# EAGLE schematic flip (EAGLE 6.2), part 1 of 2
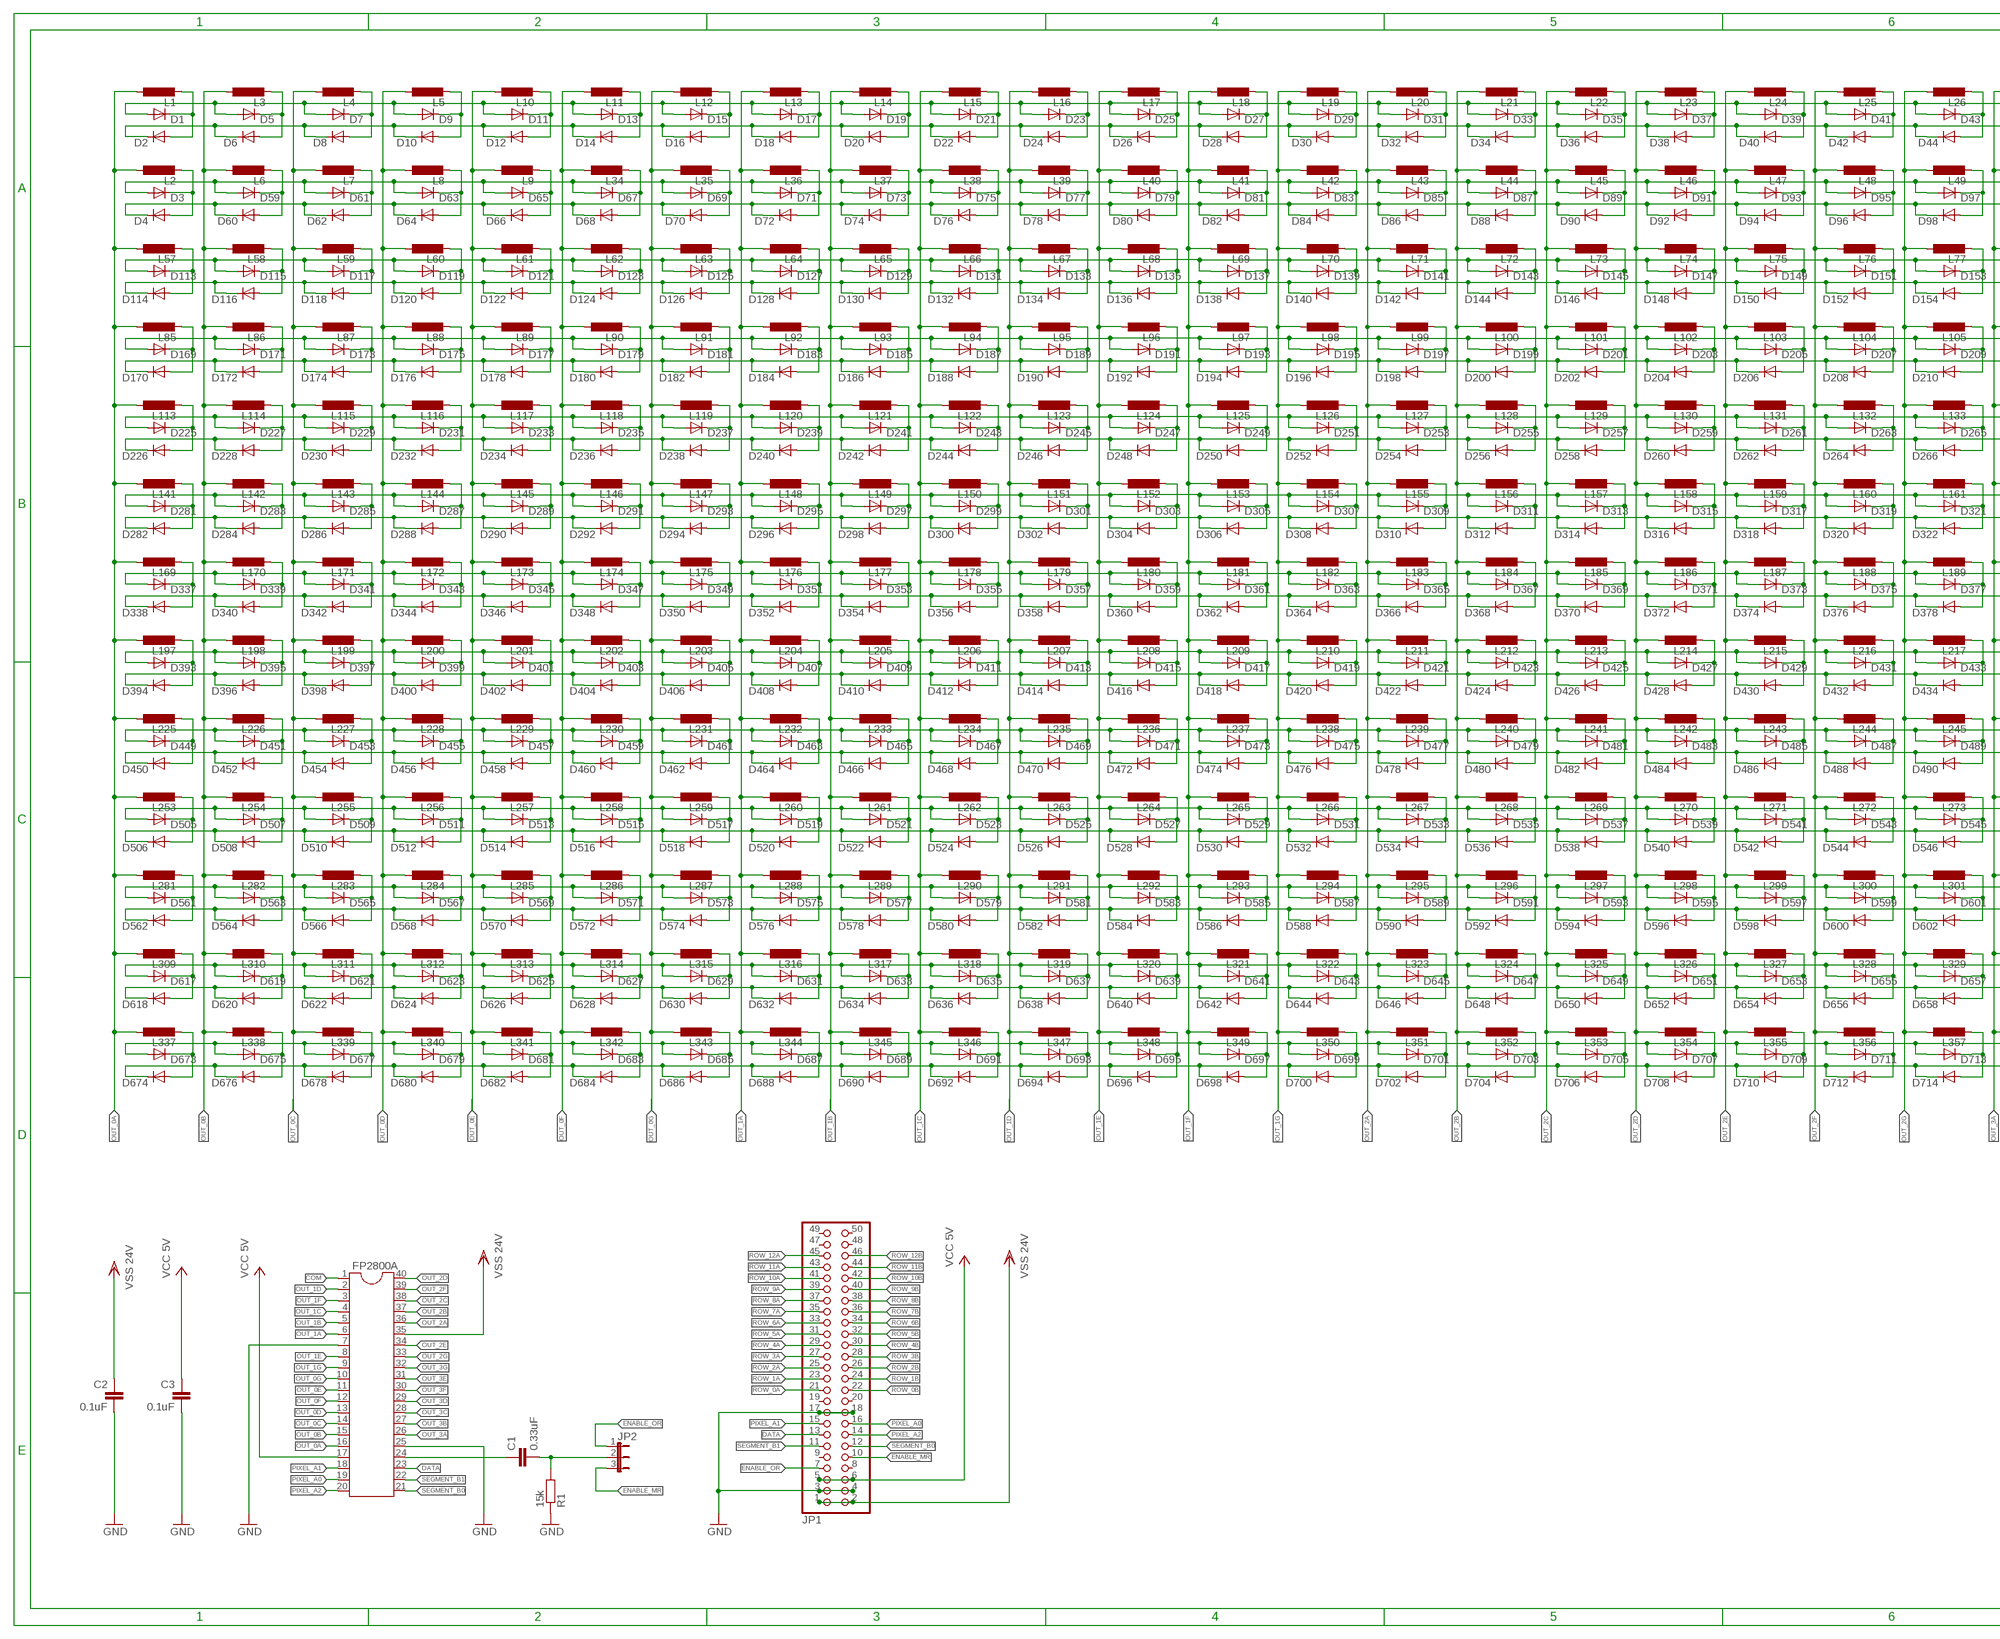
[diagram p0: schematic, sheet 1, part 1 of 2]
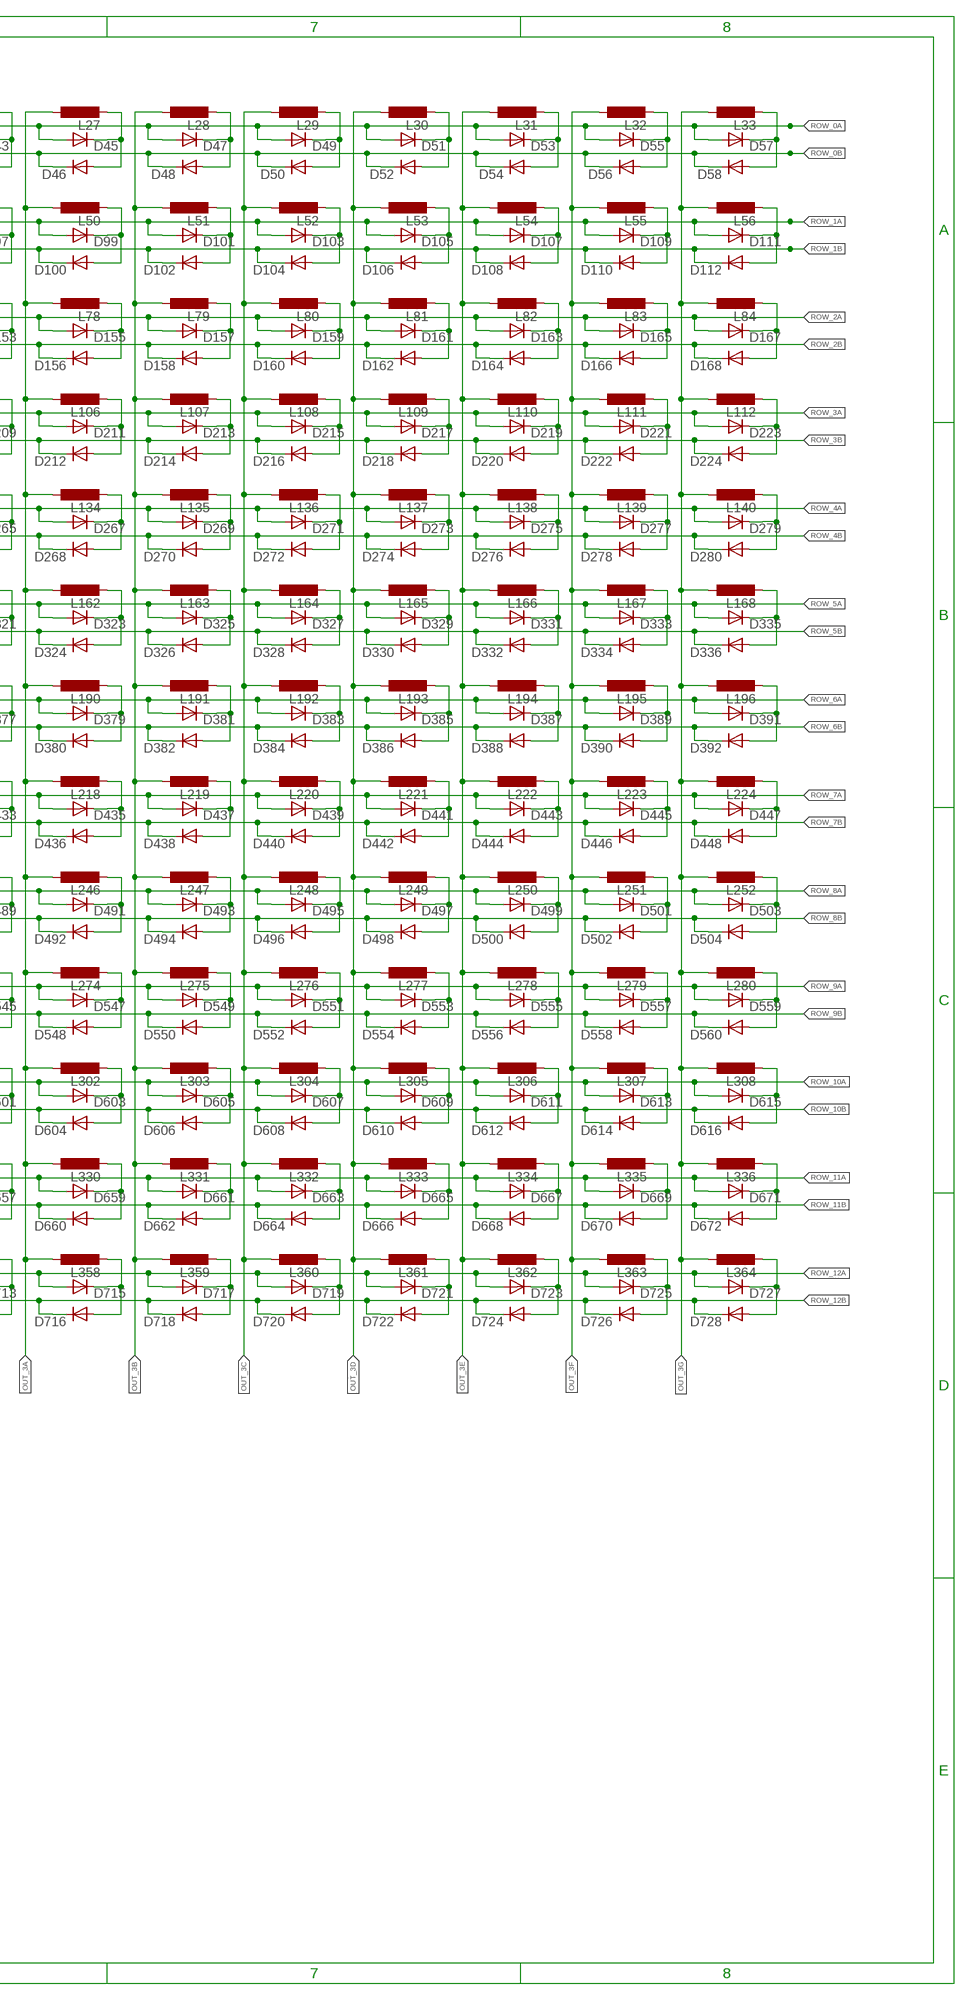
[diagram p1: schematic, sheet 1, part 2 of 2]

## Parts
C1  0.33uF  C-EU075-032X103  [C075-032X103]
C2  0.1uF  C-EU075-032X103  [C075-032X103]
C3  0.1uF  C-EU075-032X103  [C075-032X103]
D1  1N4446  [DO35-10]
D2  1N4446  [DO35-10]
D3  1N4446  [DO35-10]
D4  1N4446  [DO35-10]
D5  1N4446  [DO35-10]
D6  1N4446  [DO35-10]
D7  1N4446  [DO35-10]
D8  1N4446  [DO35-10]
D9  1N4446  [DO35-10]
D10  1N4446  [DO35-10]
D11  1N4446  [DO35-10]
D12  1N4446  [DO35-10]
D13  1N4446  [DO35-10]
D14  1N4446  [DO35-10]
D15  1N4446  [DO35-10]
D16  1N4446  [DO35-10]
D17  1N4446  [DO35-10]
D18  1N4446  [DO35-10]
D19  1N4446  [DO35-10]
D20  1N4446  [DO35-10]
D21  1N4446  [DO35-10]
D22  1N4446  [DO35-10]
D23  1N4446  [DO35-10]
D24  1N4446  [DO35-10]
D25  1N4446  [DO35-10]
D26  1N4446  [DO35-10]
D27  1N4446  [DO35-10]
D28  1N4446  [DO35-10]
D29  1N4446  [DO35-10]
D30  1N4446  [DO35-10]
D31  1N4446  [DO35-10]
D32  1N4446  [DO35-10]
D33  1N4446  [DO35-10]
D34  1N4446  [DO35-10]
D35  1N4446  [DO35-10]
D36  1N4446  [DO35-10]
D37  1N4446  [DO35-10]
D38  1N4446  [DO35-10]
D39  1N4446  [DO35-10]
D40  1N4446  [DO35-10]
D41  1N4446  [DO35-10]
D42  1N4446  [DO35-10]
D43  1N4446  [DO35-10]
D44  1N4446  [DO35-10]
D45  1N4446  [DO35-10]
D46  1N4446  [DO35-10]
D47  1N4446  [DO35-10]
D48  1N4446  [DO35-10]
D49  1N4446  [DO35-10]
D50  1N4446  [DO35-10]
D51  1N4446  [DO35-10]
D52  1N4446  [DO35-10]
D53  1N4446  [DO35-10]
D54  1N4446  [DO35-10]
D55  1N4446  [DO35-10]
D56  1N4446  [DO35-10]
D57  1N4446  [DO35-10]
D58  1N4446  [DO35-10]
D59  1N4446  [DO35-10]
D60  1N4446  [DO35-10]
D61  1N4446  [DO35-10]
D62  1N4446  [DO35-10]
D63  1N4446  [DO35-10]
D64  1N4446  [DO35-10]
D65  1N4446  [DO35-10]
D66  1N4446  [DO35-10]
D67  1N4446  [DO35-10]
D68  1N4446  [DO35-10]
D69  1N4446  [DO35-10]
D70  1N4446  [DO35-10]
D71  1N4446  [DO35-10]
D72  1N4446  [DO35-10]
D73  1N4446  [DO35-10]
D74  1N4446  [DO35-10]
D75  1N4446  [DO35-10]
D76  1N4446  [DO35-10]
D77  1N4446  [DO35-10]
D78  1N4446  [DO35-10]
D79  1N4446  [DO35-10]
D80  1N4446  [DO35-10]
D81  1N4446  [DO35-10]
D82  1N4446  [DO35-10]
D83  1N4446  [DO35-10]
D84  1N4446  [DO35-10]
D85  1N4446  [DO35-10]
D86  1N4446  [DO35-10]
D87  1N4446  [DO35-10]
D88  1N4446  [DO35-10]
D89  1N4446  [DO35-10]
D90  1N4446  [DO35-10]
D91  1N4446  [DO35-10]
D92  1N4446  [DO35-10]
D93  1N4446  [DO35-10]
D94  1N4446  [DO35-10]
D95  1N4446  [DO35-10]
D96  1N4446  [DO35-10]
D97  1N4446  [DO35-10]
D98  1N4446  [DO35-10]
D99  1N4446  [DO35-10]
D100  1N4446  [DO35-10]
D101  1N4446  [DO35-10]
D102  1N4446  [DO35-10]
D103  1N4446  [DO35-10]
D104  1N4446  [DO35-10]
D105  1N4446  [DO35-10]
D106  1N4446  [DO35-10]
D107  1N4446  [DO35-10]
D108  1N4446  [DO35-10]
D109  1N4446  [DO35-10]
D110  1N4446  [DO35-10]
D111  1N4446  [DO35-10]
D112  1N4446  [DO35-10]
D113  1N4446  [DO35-10]
D114  1N4446  [DO35-10]
D115  1N4446  [DO35-10]
D116  1N4446  [DO35-10]
D117  1N4446  [DO35-10]
D118  1N4446  [DO35-10]
D119  1N4446  [DO35-10]
D120  1N4446  [DO35-10]
D121  1N4446  [DO35-10]
D122  1N4446  [DO35-10]
D123  1N4446  [DO35-10]
D124  1N4446  [DO35-10]
D125  1N4446  [DO35-10]
D126  1N4446  [DO35-10]
D127  1N4446  [DO35-10]
D128  1N4446  [DO35-10]
D129  1N4446  [DO35-10]
D130  1N4446  [DO35-10]
D131  1N4446  [DO35-10]
D132  1N4446  [DO35-10]
D133  1N4446  [DO35-10]
D134  1N4446  [DO35-10]
D135  1N4446  [DO35-10]
D136  1N4446  [DO35-10]
D137  1N4446  [DO35-10]
D138  1N4446  [DO35-10]
D139  1N4446  [DO35-10]
D140  1N4446  [DO35-10]
D141  1N4446  [DO35-10]
D142  1N4446  [DO35-10]
D143  1N4446  [DO35-10]
D144  1N4446  [DO35-10]
D145  1N4446  [DO35-10]
D146  1N4446  [DO35-10]
D147  1N4446  [DO35-10]
D148  1N4446  [DO35-10]
D149  1N4446  [DO35-10]
D150  1N4446  [DO35-10]
D151  1N4446  [DO35-10]
D152  1N4446  [DO35-10]
D153  1N4446  [DO35-10]
D154  1N4446  [DO35-10]
D155  1N4446  [DO35-10]
D156  1N4446  [DO35-10]
D157  1N4446  [DO35-10]
D158  1N4446  [DO35-10]
D159  1N4446  [DO35-10]
D160  1N4446  [DO35-10]
D161  1N4446  [DO35-10]
D162  1N4446  [DO35-10]
D163  1N4446  [DO35-10]
D164  1N4446  [DO35-10]
D165  1N4446  [DO35-10]
D166  1N4446  [DO35-10]
D167  1N4446  [DO35-10]
D168  1N4446  [DO35-10]
D169  1N4446  [DO35-10]
D170  1N4446  [DO35-10]
D171  1N4446  [DO35-10]
D172  1N4446  [DO35-10]
D173  1N4446  [DO35-10]
D174  1N4446  [DO35-10]
D175  1N4446  [DO35-10]
D176  1N4446  [DO35-10]
D177  1N4446  [DO35-10]
D178  1N4446  [DO35-10]
D179  1N4446  [DO35-10]
D180  1N4446  [DO35-10]
D181  1N4446  [DO35-10]
D182  1N4446  [DO35-10]
D183  1N4446  [DO35-10]
D184  1N4446  [DO35-10]
D185  1N4446  [DO35-10]
D186  1N4446  [DO35-10]
D187  1N4446  [DO35-10]
D188  1N4446  [DO35-10]
D189  1N4446  [DO35-10]
D190  1N4446  [DO35-10]
D191  1N4446  [DO35-10]
D192  1N4446  [DO35-10]
D193  1N4446  [DO35-10]
D194  1N4446  [DO35-10]
D195  1N4446  [DO35-10]
D196  1N4446  [DO35-10]
D197  1N4446  [DO35-10]
D198  1N4446  [DO35-10]
D199  1N4446  [DO35-10]
D200  1N4446  [DO35-10]
D201  1N4446  [DO35-10]
D202  1N4446  [DO35-10]
D203  1N4446  [DO35-10]
D204  1N4446  [DO35-10]
D205  1N4446  [DO35-10]
D206  1N4446  [DO35-10]
D207  1N4446  [DO35-10]
D208  1N4446  [DO35-10]
D209  1N4446  [DO35-10]
D210  1N4446  [DO35-10]
D211  1N4446  [DO35-10]
D212  1N4446  [DO35-10]
D213  1N4446  [DO35-10]
D214  1N4446  [DO35-10]
D215  1N4446  [DO35-10]
D216  1N4446  [DO35-10]
D217  1N4446  [DO35-10]
D218  1N4446  [DO35-10]
D219  1N4446  [DO35-10]
D220  1N4446  [DO35-10]
D221  1N4446  [DO35-10]
D222  1N4446  [DO35-10]
D223  1N4446  [DO35-10]
D224  1N4446  [DO35-10]
D225  1N4446  [DO35-10]
D226  1N4446  [DO35-10]
D227  1N4446  [DO35-10]
D228  1N4446  [DO35-10]
D229  1N4446  [DO35-10]
D230  1N4446  [DO35-10]
D231  1N4446  [DO35-10]
D232  1N4446  [DO35-10]
D233  1N4446  [DO35-10]
D234  1N4446  [DO35-10]
D235  1N4446  [DO35-10]
D236  1N4446  [DO35-10]
D237  1N4446  [DO35-10]
D238  1N4446  [DO35-10]
D239  1N4446  [DO35-10]
D240  1N4446  [DO35-10]
D241  1N4446  [DO35-10]
D242  1N4446  [DO35-10]
D243  1N4446  [DO35-10]
D244  1N4446  [DO35-10]
D245  1N4446  [DO35-10]
D246  1N4446  [DO35-10]
D247  1N4446  [DO35-10]
D248  1N4446  [DO35-10]
D249  1N4446  [DO35-10]
D250  1N4446  [DO35-10]
D251  1N4446  [DO35-10]
D252  1N4446  [DO35-10]
D253  1N4446  [DO35-10]
D254  1N4446  [DO35-10]
D255  1N4446  [DO35-10]
D256  1N4446  [DO35-10]
D257  1N4446  [DO35-10]
D258  1N4446  [DO35-10]
D259  1N4446  [DO35-10]
D260  1N4446  [DO35-10]
D261  1N4446  [DO35-10]
D262  1N4446  [DO35-10]
D263  1N4446  [DO35-10]
D264  1N4446  [DO35-10]
D265  1N4446  [DO35-10]
D266  1N4446  [DO35-10]
D267  1N4446  [DO35-10]
D268  1N4446  [DO35-10]
D269  1N4446  [DO35-10]
D270  1N4446  [DO35-10]
D271  1N4446  [DO35-10]
D272  1N4446  [DO35-10]
D273  1N4446  [DO35-10]
D274  1N4446  [DO35-10]
D275  1N4446  [DO35-10]
D276  1N4446  [DO35-10]
D277  1N4446  [DO35-10]
D278  1N4446  [DO35-10]
D279  1N4446  [DO35-10]
D280  1N4446  [DO35-10]
D281  1N4446  [DO35-10]
D282  1N4446  [DO35-10]
D283  1N4446  [DO35-10]
D284  1N4446  [DO35-10]
D285  1N4446  [DO35-10]
D286  1N4446  [DO35-10]
D287  1N4446  [DO35-10]
D288  1N4446  [DO35-10]
D289  1N4446  [DO35-10]
D290  1N4446  [DO35-10]
D291  1N4446  [DO35-10]
D292  1N4446  [DO35-10]
D293  1N4446  [DO35-10]
D294  1N4446  [DO35-10]
D295  1N4446  [DO35-10]
D296  1N4446  [DO35-10]
D297  1N4446  [DO35-10]
D298  1N4446  [DO35-10]
D299  1N4446  [DO35-10]
D300  1N4446  [DO35-10]
D301  1N4446  [DO35-10]
D302  1N4446  [DO35-10]
D303  1N4446  [DO35-10]
D304  1N4446  [DO35-10]
D305  1N4446  [DO35-10]
D306  1N4446  [DO35-10]
D307  1N4446  [DO35-10]
D308  1N4446  [DO35-10]
D309  1N4446  [DO35-10]
D310  1N4446  [DO35-10]
D311  1N4446  [DO35-10]
D312  1N4446  [DO35-10]
D313  1N4446  [DO35-10]
D314  1N4446  [DO35-10]
D315  1N4446  [DO35-10]
D316  1N4446  [DO35-10]
D317  1N4446  [DO35-10]
D318  1N4446  [DO35-10]
D319  1N4446  [DO35-10]
D320  1N4446  [DO35-10]
D321  1N4446  [DO35-10]
D322  1N4446  [DO35-10]
D323  1N4446  [DO35-10]
D324  1N4446  [DO35-10]
D325  1N4446  [DO35-10]
D326  1N4446  [DO35-10]
D327  1N4446  [DO35-10]
D328  1N4446  [DO35-10]
D329  1N4446  [DO35-10]
D330  1N4446  [DO35-10]
D331  1N4446  [DO35-10]
D332  1N4446  [DO35-10]
D333  1N4446  [DO35-10]
D334  1N4446  [DO35-10]
D335  1N4446  [DO35-10]
D336  1N4446  [DO35-10]
D337  1N4446  [DO35-10]
D338  1N4446  [DO35-10]
D339  1N4446  [DO35-10]
D340  1N4446  [DO35-10]
D341  1N4446  [DO35-10]
D342  1N4446  [DO35-10]
D343  1N4446  [DO35-10]
D344  1N4446  [DO35-10]
D345  1N4446  [DO35-10]
D346  1N4446  [DO35-10]
D347  1N4446  [DO35-10]
D348  1N4446  [DO35-10]
D349  1N4446  [DO35-10]
D350  1N4446  [DO35-10]
D351  1N4446  [DO35-10]
D352  1N4446  [DO35-10]
D353  1N4446  [DO35-10]
D354  1N4446  [DO35-10]
D355  1N4446  [DO35-10]
D356  1N4446  [DO35-10]
D357  1N4446  [DO35-10]
D358  1N4446  [DO35-10]
D359  1N4446  [DO35-10]
D360  1N4446  [DO35-10]
D361  1N4446  [DO35-10]
D362  1N4446  [DO35-10]
D363  1N4446  [DO35-10]
D364  1N4446  [DO35-10]
D365  1N4446  [DO35-10]
D366  1N4446  [DO35-10]
D367  1N4446  [DO35-10]
D368  1N4446  [DO35-10]
D369  1N4446  [DO35-10]
D370  1N4446  [DO35-10]
D371  1N4446  [DO35-10]
D372  1N4446  [DO35-10]
D373  1N4446  [DO35-10]
D374  1N4446  [DO35-10]
D375  1N4446  [DO35-10]
D376  1N4446  [DO35-10]
D377  1N4446  [DO35-10]
D378  1N4446  [DO35-10]
D379  1N4446  [DO35-10]
D380  1N4446  [DO35-10]
D381  1N4446  [DO35-10]
D382  1N4446  [DO35-10]
D383  1N4446  [DO35-10]
D384  1N4446  [DO35-10]
D385  1N4446  [DO35-10]
D386  1N4446  [DO35-10]
D387  1N4446  [DO35-10]
D388  1N4446  [DO35-10]
D389  1N4446  [DO35-10]
D390  1N4446  [DO35-10]
D391  1N4446  [DO35-10]
D392  1N4446  [DO35-10]
D393  1N4446  [DO35-10]
D394  1N4446  [DO35-10]
D395  1N4446  [DO35-10]
D396  1N4446  [DO35-10]
D397  1N4446  [DO35-10]
D398  1N4446  [DO35-10]
D399  1N4446  [DO35-10]
D400  1N4446  [DO35-10]
D401  1N4446  [DO35-10]
D402  1N4446  [DO35-10]
D403  1N4446  [DO35-10]
D404  1N4446  [DO35-10]
D405  1N4446  [DO35-10]
D406  1N4446  [DO35-10]
D407  1N4446  [DO35-10]
D408  1N4446  [DO35-10]
D409  1N4446  [DO35-10]
D410  1N4446  [DO35-10]
D411  1N4446  [DO35-10]
D412  1N4446  [DO35-10]
D413  1N4446  [DO35-10]
D414  1N4446  [DO35-10]
D415  1N4446  [DO35-10]
D416  1N4446  [DO35-10]
D417  1N4446  [DO35-10]
D418  1N4446  [DO35-10]
D419  1N4446  [DO35-10]
D420  1N4446  [DO35-10]
D421  1N4446  [DO35-10]
D422  1N4446  [DO35-10]
D423  1N4446  [DO35-10]
D424  1N4446  [DO35-10]
D425  1N4446  [DO35-10]
D426  1N4446  [DO35-10]
D427  1N4446  [DO35-10]
D428  1N4446  [DO35-10]
D429  1N4446  [DO35-10]
D430  1N4446  [DO35-10]
D431  1N4446  [DO35-10]
D432  1N4446  [DO35-10]
D433  1N4446  [DO35-10]
D434  1N4446  [DO35-10]
D435  1N4446  [DO35-10]
D436  1N4446  [DO35-10]
D437  1N4446  [DO35-10]
D438  1N4446  [DO35-10]
D439  1N4446  [DO35-10]
D440  1N4446  [DO35-10]
D441  1N4446  [DO35-10]
D442  1N4446  [DO35-10]
D443  1N4446  [DO35-10]
D444  1N4446  [DO35-10]
D445  1N4446  [DO35-10]
D446  1N4446  [DO35-10]
D447  1N4446  [DO35-10]
D448  1N4446  [DO35-10]
D449  1N4446  [DO35-10]
D450  1N4446  [DO35-10]
D451  1N4446  [DO35-10]
D452  1N4446  [DO35-10]
D453  1N4446  [DO35-10]
D454  1N4446  [DO35-10]
D455  1N4446  [DO35-10]
D456  1N4446  [DO35-10]
D457  1N4446  [DO35-10]
D458  1N4446  [DO35-10]
D459  1N4446  [DO35-10]
D460  1N4446  [DO35-10]
D461  1N4446  [DO35-10]
D462  1N4446  [DO35-10]
D463  1N4446  [DO35-10]
D464  1N4446  [DO35-10]
D465  1N4446  [DO35-10]
D466  1N4446  [DO35-10]
D467  1N4446  [DO35-10]
D468  1N4446  [DO35-10]
D469  1N4446  [DO35-10]
D470  1N4446  [DO35-10]
D471  1N4446  [DO35-10]
D472  1N4446  [DO35-10]
D473  1N4446  [DO35-10]
D474  1N4446  [DO35-10]
D475  1N4446  [DO35-10]
D476  1N4446  [DO35-10]
D477  1N4446  [DO35-10]
D478  1N4446  [DO35-10]
D479  1N4446  [DO35-10]
D480  1N4446  [DO35-10]
D481  1N4446  [DO35-10]
D482  1N4446  [DO35-10]
D483  1N4446  [DO35-10]
D484  1N4446  [DO35-10]
D485  1N4446  [DO35-10]
D486  1N4446  [DO35-10]
D487  1N4446  [DO35-10]
D488  1N4446  [DO35-10]
D489  1N4446  [DO35-10]
D490  1N4446  [DO35-10]
D491  1N4446  [DO35-10]
D492  1N4446  [DO35-10]
D493  1N4446  [DO35-10]
D494  1N4446  [DO35-10]
D495  1N4446  [DO35-10]
D496  1N4446  [DO35-10]
D497  1N4446  [DO35-10]
D498  1N4446  [DO35-10]
D499  1N4446  [DO35-10]
D500  1N4446  [DO35-10]
D501  1N4446  [DO35-10]
D502  1N4446  [DO35-10]
D503  1N4446  [DO35-10]
D504  1N4446  [DO35-10]
D505  1N4446  [DO35-10]
D506  1N4446  [DO35-10]
D507  1N4446  [DO35-10]
D508  1N4446  [DO35-10]
D509  1N4446  [DO35-10]
D510  1N4446  [DO35-10]
D511  1N4446  [DO35-10]
D512  1N4446  [DO35-10]
D513  1N4446  [DO35-10]
D514  1N4446  [DO35-10]
D515  1N4446  [DO35-10]
D516  1N4446  [DO35-10]
D517  1N4446  [DO35-10]
D518  1N4446  [DO35-10]
D519  1N4446  [DO35-10]
D520  1N4446  [DO35-10]
D521  1N4446  [DO35-10]
D522  1N4446  [DO35-10]
D523  1N4446  [DO35-10]
D524  1N4446  [DO35-10]
D525  1N4446  [DO35-10]
D526  1N4446  [DO35-10]
D527  1N4446  [DO35-10]
D528  1N4446  [DO35-10]
D529  1N4446  [DO35-10]
D530  1N4446  [DO35-10]
D531  1N4446  [DO35-10]
D532  1N4446  [DO35-10]
D533  1N4446  [DO35-10]
D534  1N4446  [DO35-10]
D535  1N4446  [DO35-10]
D536  1N4446  [DO35-10]
D537  1N4446  [DO35-10]
D538  1N4446  [DO35-10]
D539  1N4446  [DO35-10]
D540  1N4446  [DO35-10]
D541  1N4446  [DO35-10]
D542  1N4446  [DO35-10]
D543  1N4446  [DO35-10]
D544  1N4446  [DO35-10]
D545  1N4446  [DO35-10]
D546  1N4446  [DO35-10]
D547  1N4446  [DO35-10]
D548  1N4446  [DO35-10]
D549  1N4446  [DO35-10]
D550  1N4446  [DO35-10]
D551  1N4446  [DO35-10]
D552  1N4446  [DO35-10]
D553  1N4446  [DO35-10]
D554  1N4446  [DO35-10]
D555  1N4446  [DO35-10]
D556  1N4446  [DO35-10]
D557  1N4446  [DO35-10]
D558  1N4446  [DO35-10]
D559  1N4446  [DO35-10]
D560  1N4446  [DO35-10]
D561  1N4446  [DO35-10]
D562  1N4446  [DO35-10]
D563  1N4446  [DO35-10]
D564  1N4446  [DO35-10]
D565  1N4446  [DO35-10]
D566  1N4446  [DO35-10]
D567  1N4446  [DO35-10]
D568  1N4446  [DO35-10]
D569  1N4446  [DO35-10]
D570  1N4446  [DO35-10]
D571  1N4446  [DO35-10]
D572  1N4446  [DO35-10]
D573  1N4446  [DO35-10]
D574  1N4446  [DO35-10]
D575  1N4446  [DO35-10]
D576  1N4446  [DO35-10]
D577  1N4446  [DO35-10]
D578  1N4446  [DO35-10]
D579  1N4446  [DO35-10]
D580  1N4446  [DO35-10]
D581  1N4446  [DO35-10]
D582  1N4446  [DO35-10]
D583  1N4446  [DO35-10]
D584  1N4446  [DO35-10]
D585  1N4446  [DO35-10]
D586  1N4446  [DO35-10]
D587  1N4446  [DO35-10]
D588  1N4446  [DO35-10]
D589  1N4446  [DO35-10]
D590  1N4446  [DO35-10]
D591  1N4446  [DO35-10]
D592  1N4446  [DO35-10]
D593  1N4446  [DO35-10]
D594  1N4446  [DO35-10]
D595  1N4446  [DO35-10]
D596  1N4446  [DO35-10]
D597  1N4446  [DO35-10]
D598  1N4446  [DO35-10]
D599  1N4446  [DO35-10]
D600  1N4446  [DO35-10]
D601  1N4446  [DO35-10]
D602  1N4446  [DO35-10]
D603  1N4446  [DO35-10]
D604  1N4446  [DO35-10]
D605  1N4446  [DO35-10]
D606  1N4446  [DO35-10]
D607  1N4446  [DO35-10]
D608  1N4446  [DO35-10]
D609  1N4446  [DO35-10]
D610  1N4446  [DO35-10]
D611  1N4446  [DO35-10]
D612  1N4446  [DO35-10]
D613  1N4446  [DO35-10]
D614  1N4446  [DO35-10]
D615  1N4446  [DO35-10]
D616  1N4446  [DO35-10]
D617  1N4446  [DO35-10]
D618  1N4446  [DO35-10]
D619  1N4446  [DO35-10]
D620  1N4446  [DO35-10]
D621  1N4446  [DO35-10]
D622  1N4446  [DO35-10]
D623  1N4446  [DO35-10]
D624  1N4446  [DO35-10]
D625  1N4446  [DO35-10]
D626  1N4446  [DO35-10]
D627  1N4446  [DO35-10]
D628  1N4446  [DO35-10]
D629  1N4446  [DO35-10]
D630  1N4446  [DO35-10]
D631  1N4446  [DO35-10]
D632  1N4446  [DO35-10]
D633  1N4446  [DO35-10]
D634  1N4446  [DO35-10]
D635  1N4446  [DO35-10]
D636  1N4446  [DO35-10]
D637  1N4446  [DO35-10]
D638  1N4446  [DO35-10]
D639  1N4446  [DO35-10]
D640  1N4446  [DO35-10]
D641  1N4446  [DO35-10]
D642  1N4446  [DO35-10]
D643  1N4446  [DO35-10]
D644  1N4446  [DO35-10]
D645  1N4446  [DO35-10]
D646  1N4446  [DO35-10]
D647  1N4446  [DO35-10]
D648  1N4446  [DO35-10]
D649  1N4446  [DO35-10]
D650  1N4446  [DO35-10]
D651  1N4446  [DO35-10]
D652  1N4446  [DO35-10]
D653  1N4446  [DO35-10]
D654  1N4446  [DO35-10]
D655  1N4446  [DO35-10]
D656  1N4446  [DO35-10]
D657  1N4446  [DO35-10]
D658  1N4446  [DO35-10]
D659  1N4446  [DO35-10]
D660  1N4446  [DO35-10]
D661  1N4446  [DO35-10]
D662  1N4446  [DO35-10]
D663  1N4446  [DO35-10]
D664  1N4446  [DO35-10]
D665  1N4446  [DO35-10]
D666  1N4446  [DO35-10]
D667  1N4446  [DO35-10]
D668  1N4446  [DO35-10]
D669  1N4446  [DO35-10]
D670  1N4446  [DO35-10]
D671  1N4446  [DO35-10]
D672  1N4446  [DO35-10]
D673  1N4446  [DO35-10]
D674  1N4446  [DO35-10]
D675  1N4446  [DO35-10]
D676  1N4446  [DO35-10]
D677  1N4446  [DO35-10]
D678  1N4446  [DO35-10]
D679  1N4446  [DO35-10]
D680  1N4446  [DO35-10]
D681  1N4446  [DO35-10]
D682  1N4446  [DO35-10]
D683  1N4446  [DO35-10]
D684  1N4446  [DO35-10]
D685  1N4446  [DO35-10]
D686  1N4446  [DO35-10]
D687  1N4446  [DO35-10]
D688  1N4446  [DO35-10]
D689  1N4446  [DO35-10]
D690  1N4446  [DO35-10]
D691  1N4446  [DO35-10]
D692  1N4446  [DO35-10]
D693  1N4446  [DO35-10]
D694  1N4446  [DO35-10]
D695  1N4446  [DO35-10]
D696  1N4446  [DO35-10]
D697  1N4446  [DO35-10]
D698  1N4446  [DO35-10]
D699  1N4446  [DO35-10]
D700  1N4446  [DO35-10]
D701  1N4446  [DO35-10]
D702  1N4446  [DO35-10]
D703  1N4446  [DO35-10]
D704  1N4446  [DO35-10]
D705  1N4446  [DO35-10]
D706  1N4446  [DO35-10]
D707  1N4446  [DO35-10]
D708  1N4446  [DO35-10]
D709  1N4446  [DO35-10]
D710  1N4446  [DO35-10]
D711  1N4446  [DO35-10]
D712  1N4446  [DO35-10]
D713  1N4446  [DO35-10]
D714  1N4446  [DO35-10]
D715  1N4446  [DO35-10]
D716  1N4446  [DO35-10]
D717  1N4446  [DO35-10]
D718  1N4446  [DO35-10]
D719  1N4446  [DO35-10]
D720  1N4446  [DO35-10]
D721  1N4446  [DO35-10]
D722  1N4446  [DO35-10]
D723  1N4446  [DO35-10]
D724  1N4446  [DO35-10]
D725  1N4446  [DO35-10]
D726  1N4446  [DO35-10]
D727  1N4446  [DO35-10]
D728  1N4446  [DO35-10]
FP2800A  DIL40  [DIL40]
JP1  PINHD-2X25  [2X25]
JP2  JP2E  [JP2]
L1  L-EU0204/7  [0204/7]
L2  L-EU0204/7  [0204/7]
L3  L-EU0204/7  [0204/7]
L4  L-EU0204/7  [0204/7]
L5  L-EU0204/7  [0204/7]
L6  L-EU0204/7  [0204/7]
L7  L-EU0204/7  [0204/7]
L8  L-EU0204/7  [0204/7]
L9  L-EU0204/7  [0204/7]
L10  L-EU0204/7  [0204/7]
L11  L-EU0204/7  [0204/7]
L12  L-EU0204/7  [0204/7]
L13  L-EU0204/7  [0204/7]
L14  L-EU0204/7  [0204/7]
L15  L-EU0204/7  [0204/7]
L16  L-EU0204/7  [0204/7]
L17  L-EU0204/7  [0204/7]
L18  L-EU0204/7  [0204/7]
L19  L-EU0204/7  [0204/7]
L20  L-EU0204/7  [0204/7]
L21  L-EU0204/7  [0204/7]
L22  L-EU0204/7  [0204/7]
L23  L-EU0204/7  [0204/7]
L24  L-EU0204/7  [0204/7]
L25  L-EU0204/7  [0204/7]
L26  L-EU0204/7  [0204/7]
L27  L-EU0204/7  [0204/7]
L28  L-EU0204/7  [0204/7]
L29  L-EU0204/7  [0204/7]
L30  L-EU0204/7  [0204/7]
L31  L-EU0204/7  [0204/7]
L32  L-EU0204/7  [0204/7]
L33  L-EU0204/7  [0204/7]
L34  L-EU0204/7  [0204/7]
L35  L-EU0204/7  [0204/7]
L36  L-EU0204/7  [0204/7]
L37  L-EU0204/7  [0204/7]
L38  L-EU0204/7  [0204/7]
L39  L-EU0204/7  [0204/7]
L40  L-EU0204/7  [0204/7]
L41  L-EU0204/7  [0204/7]
L42  L-EU0204/7  [0204/7]
L43  L-EU0204/7  [0204/7]
L44  L-EU0204/7  [0204/7]
L45  L-EU0204/7  [0204/7]
L46  L-EU0204/7  [0204/7]
L47  L-EU0204/7  [0204/7]
L48  L-EU0204/7  [0204/7]
L49  L-EU0204/7  [0204/7]
L50  L-EU0204/7  [0204/7]
L51  L-EU0204/7  [0204/7]
L52  L-EU0204/7  [0204/7]
L53  L-EU0204/7  [0204/7]
L54  L-EU0204/7  [0204/7]
L55  L-EU0204/7  [0204/7]
L56  L-EU0204/7  [0204/7]
L57  L-EU0204/7  [0204/7]
L58  L-EU0204/7  [0204/7]
L59  L-EU0204/7  [0204/7]
L60  L-EU0204/7  [0204/7]
L61  L-EU0204/7  [0204/7]
L62  L-EU0204/7  [0204/7]
L63  L-EU0204/7  [0204/7]
L64  L-EU0204/7  [0204/7]
L65  L-EU0204/7  [0204/7]
L66  L-EU0204/7  [0204/7]
L67  L-EU0204/7  [0204/7]
L68  L-EU0204/7  [0204/7]
L69  L-EU0204/7  [0204/7]
L70  L-EU0204/7  [0204/7]
L71  L-EU0204/7  [0204/7]
L72  L-EU0204/7  [0204/7]
L73  L-EU0204/7  [0204/7]
L74  L-EU0204/7  [0204/7]
L75  L-EU0204/7  [0204/7]
L76  L-EU0204/7  [0204/7]
L77  L-EU0204/7  [0204/7]
L78  L-EU0204/7  [0204/7]
L79  L-EU0204/7  [0204/7]
L80  L-EU0204/7  [0204/7]
L81  L-EU0204/7  [0204/7]
L82  L-EU0204/7  [0204/7]
L83  L-EU0204/7  [0204/7]
L84  L-EU0204/7  [0204/7]
L85  L-EU0204/7  [0204/7]
L86  L-EU0204/7  [0204/7]
L87  L-EU0204/7  [0204/7]
L88  L-EU0204/7  [0204/7]
L89  L-EU0204/7  [0204/7]
L90  L-EU0204/7  [0204/7]
L91  L-EU0204/7  [0204/7]
L92  L-EU0204/7  [0204/7]
L93  L-EU0204/7  [0204/7]
L94  L-EU0204/7  [0204/7]
L95  L-EU0204/7  [0204/7]
L96  L-EU0204/7  [0204/7]
L97  L-EU0204/7  [0204/7]
L98  L-EU0204/7  [0204/7]
L99  L-EU0204/7  [0204/7]
L100  L-EU0204/7  [0204/7]
L101  L-EU0204/7  [0204/7]
L102  L-EU0204/7  [0204/7]
L103  L-EU0204/7  [0204/7]
L104  L-EU0204/7  [0204/7]
L105  L-EU0204/7  [0204/7]
L106  L-EU0204/7  [0204/7]
L107  L-EU0204/7  [0204/7]
L108  L-EU0204/7  [0204/7]
L109  L-EU0204/7  [0204/7]
L110  L-EU0204/7  [0204/7]
L111  L-EU0204/7  [0204/7]
L112  L-EU0204/7  [0204/7]
L113  L-EU0204/7  [0204/7]
L114  L-EU0204/7  [0204/7]
L115  L-EU0204/7  [0204/7]
L116  L-EU0204/7  [0204/7]
L117  L-EU0204/7  [0204/7]
L118  L-EU0204/7  [0204/7]
L119  L-EU0204/7  [0204/7]
L120  L-EU0204/7  [0204/7]
L121  L-EU0204/7  [0204/7]
L122  L-EU0204/7  [0204/7]
L123  L-EU0204/7  [0204/7]
L124  L-EU0204/7  [0204/7]
L125  L-EU0204/7  [0204/7]
L126  L-EU0204/7  [0204/7]
L127  L-EU0204/7  [0204/7]
L128  L-EU0204/7  [0204/7]
L129  L-EU0204/7  [0204/7]
L130  L-EU0204/7  [0204/7]
L131  L-EU0204/7  [0204/7]
L132  L-EU0204/7  [0204/7]
L133  L-EU0204/7  [0204/7]
L134  L-EU0204/7  [0204/7]
L135  L-EU0204/7  [0204/7]
L136  L-EU0204/7  [0204/7]
L137  L-EU0204/7  [0204/7]
L138  L-EU0204/7  [0204/7]
L139  L-EU0204/7  [0204/7]
L140  L-EU0204/7  [0204/7]
L141  L-EU0204/7  [0204/7]
L142  L-EU0204/7  [0204/7]
L143  L-EU0204/7  [0204/7]
L144  L-EU0204/7  [0204/7]
L145  L-EU0204/7  [0204/7]
L146  L-EU0204/7  [0204/7]
L147  L-EU0204/7  [0204/7]
L148  L-EU0204/7  [0204/7]
L149  L-EU0204/7  [0204/7]
L150  L-EU0204/7  [0204/7]
L151  L-EU0204/7  [0204/7]
L152  L-EU0204/7  [0204/7]
L153  L-EU0204/7  [0204/7]
L154  L-EU0204/7  [0204/7]
L155  L-EU0204/7  [0204/7]
L156  L-EU0204/7  [0204/7]
L157  L-EU0204/7  [0204/7]
L158  L-EU0204/7  [0204/7]
L159  L-EU0204/7  [0204/7]
L160  L-EU0204/7  [0204/7]
L161  L-EU0204/7  [0204/7]
L162  L-EU0204/7  [0204/7]
L163  L-EU0204/7  [0204/7]
L164  L-EU0204/7  [0204/7]
L165  L-EU0204/7  [0204/7]
L166  L-EU0204/7  [0204/7]
L167  L-EU0204/7  [0204/7]
L168  L-EU0204/7  [0204/7]
L169  L-EU0204/7  [0204/7]
L170  L-EU0204/7  [0204/7]
L171  L-EU0204/7  [0204/7]
L172  L-EU0204/7  [0204/7]
L173  L-EU0204/7  [0204/7]
L174  L-EU0204/7  [0204/7]
L175  L-EU0204/7  [0204/7]
L176  L-EU0204/7  [0204/7]
L177  L-EU0204/7  [0204/7]
L178  L-EU0204/7  [0204/7]
L179  L-EU0204/7  [0204/7]
L180  L-EU0204/7  [0204/7]
L181  L-EU0204/7  [0204/7]
L182  L-EU0204/7  [0204/7]
L183  L-EU0204/7  [0204/7]
L184  L-EU0204/7  [0204/7]
L185  L-EU0204/7  [0204/7]
L186  L-EU0204/7  [0204/7]
L187  L-EU0204/7  [0204/7]
L188  L-EU0204/7  [0204/7]
L189  L-EU0204/7  [0204/7]
L190  L-EU0204/7  [0204/7]
L191  L-EU0204/7  [0204/7]
L192  L-EU0204/7  [0204/7]
L193  L-EU0204/7  [0204/7]
L194  L-EU0204/7  [0204/7]
L195  L-EU0204/7  [0204/7]
L196  L-EU0204/7  [0204/7]
L197  L-EU0204/7  [0204/7]
L198  L-EU0204/7  [0204/7]
L199  L-EU0204/7  [0204/7]
L200  L-EU0204/7  [0204/7]
L201  L-EU0204/7  [0204/7]
L202  L-EU0204/7  [0204/7]
L203  L-EU0204/7  [0204/7]
L204  L-EU0204/7  [0204/7]
L205  L-EU0204/7  [0204/7]
L206  L-EU0204/7  [0204/7]
L207  L-EU0204/7  [0204/7]
L208  L-EU0204/7  [0204/7]
L209  L-EU0204/7  [0204/7]
L210  L-EU0204/7  [0204/7]
L211  L-EU0204/7  [0204/7]
L212  L-EU0204/7  [0204/7]
L213  L-EU0204/7  [0204/7]
L214  L-EU0204/7  [0204/7]
L215  L-EU0204/7  [0204/7]
L216  L-EU0204/7  [0204/7]
L217  L-EU0204/7  [0204/7]
L218  L-EU0204/7  [0204/7]
L219  L-EU0204/7  [0204/7]
L220  L-EU0204/7  [0204/7]
L221  L-EU0204/7  [0204/7]
L222  L-EU0204/7  [0204/7]
L223  L-EU0204/7  [0204/7]
L224  L-EU0204/7  [0204/7]
L225  L-EU0204/7  [0204/7]
L226  L-EU0204/7  [0204/7]
L227  L-EU0204/7  [0204/7]
L228  L-EU0204/7  [0204/7]
L229  L-EU0204/7  [0204/7]
L230  L-EU0204/7  [0204/7]
L231  L-EU0204/7  [0204/7]
L232  L-EU0204/7  [0204/7]
L233  L-EU0204/7  [0204/7]
L234  L-EU0204/7  [0204/7]
L235  L-EU0204/7  [0204/7]
L236  L-EU0204/7  [0204/7]
L237  L-EU0204/7  [0204/7]
L238  L-EU0204/7  [0204/7]
L239  L-EU0204/7  [0204/7]
L240  L-EU0204/7  [0204/7]
L241  L-EU0204/7  [0204/7]
L242  L-EU0204/7  [0204/7]
L243  L-EU0204/7  [0204/7]
L244  L-EU0204/7  [0204/7]
L245  L-EU0204/7  [0204/7]
L246  L-EU0204/7  [0204/7]
L247  L-EU0204/7  [0204/7]
L248  L-EU0204/7  [0204/7]
L249  L-EU0204/7  [0204/7]
L250  L-EU0204/7  [0204/7]
L251  L-EU0204/7  [0204/7]
L252  L-EU0204/7  [0204/7]
L253  L-EU0204/7  [0204/7]
L254  L-EU0204/7  [0204/7]
L255  L-EU0204/7  [0204/7]
L256  L-EU0204/7  [0204/7]
L257  L-EU0204/7  [0204/7]
L258  L-EU0204/7  [0204/7]
L259  L-EU0204/7  [0204/7]
L260  L-EU0204/7  [0204/7]
L261  L-EU0204/7  [0204/7]
L262  L-EU0204/7  [0204/7]
L263  L-EU0204/7  [0204/7]
L264  L-EU0204/7  [0204/7]
L265  L-EU0204/7  [0204/7]
L266  L-EU0204/7  [0204/7]
L267  L-EU0204/7  [0204/7]
L268  L-EU0204/7  [0204/7]
L269  L-EU0204/7  [0204/7]
L270  L-EU0204/7  [0204/7]
L271  L-EU0204/7  [0204/7]
L272  L-EU0204/7  [0204/7]
L273  L-EU0204/7  [0204/7]
L274  L-EU0204/7  [0204/7]
L275  L-EU0204/7  [0204/7]
L276  L-EU0204/7  [0204/7]
L277  L-EU0204/7  [0204/7]
L278  L-EU0204/7  [0204/7]
L279  L-EU0204/7  [0204/7]
L280  L-EU0204/7  [0204/7]
L281  L-EU0204/7  [0204/7]
L282  L-EU0204/7  [0204/7]
L283  L-EU0204/7  [0204/7]
L284  L-EU0204/7  [0204/7]
L285  L-EU0204/7  [0204/7]
L286  L-EU0204/7  [0204/7]
L287  L-EU0204/7  [0204/7]
L288  L-EU0204/7  [0204/7]
L289  L-EU0204/7  [0204/7]
L290  L-EU0204/7  [0204/7]
L291  L-EU0204/7  [0204/7]
L292  L-EU0204/7  [0204/7]
L293  L-EU0204/7  [0204/7]
L294  L-EU0204/7  [0204/7]
L295  L-EU0204/7  [0204/7]
L296  L-EU0204/7  [0204/7]
L297  L-EU0204/7  [0204/7]
L298  L-EU0204/7  [0204/7]
L299  L-EU0204/7  [0204/7]
L300  L-EU0204/7  [0204/7]
L301  L-EU0204/7  [0204/7]
L302  L-EU0204/7  [0204/7]
L303  L-EU0204/7  [0204/7]
L304  L-EU0204/7  [0204/7]
L305  L-EU0204/7  [0204/7]
L306  L-EU0204/7  [0204/7]
L307  L-EU0204/7  [0204/7]
L308  L-EU0204/7  [0204/7]
L309  L-EU0204/7  [0204/7]
L310  L-EU0204/7  [0204/7]
L311  L-EU0204/7  [0204/7]
L312  L-EU0204/7  [0204/7]
L313  L-EU0204/7  [0204/7]
L314  L-EU0204/7  [0204/7]
L315  L-EU0204/7  [0204/7]
L316  L-EU0204/7  [0204/7]
L317  L-EU0204/7  [0204/7]
L318  L-EU0204/7  [0204/7]
L319  L-EU0204/7  [0204/7]
L320  L-EU0204/7  [0204/7]
L321  L-EU0204/7  [0204/7]
L322  L-EU0204/7  [0204/7]
L323  L-EU0204/7  [0204/7]
L324  L-EU0204/7  [0204/7]
L325  L-EU0204/7  [0204/7]
L326  L-EU0204/7  [0204/7]
L327  L-EU0204/7  [0204/7]
L328  L-EU0204/7  [0204/7]
L329  L-EU0204/7  [0204/7]
L330  L-EU0204/7  [0204/7]
L331  L-EU0204/7  [0204/7]
L332  L-EU0204/7  [0204/7]
L333  L-EU0204/7  [0204/7]
L334  L-EU0204/7  [0204/7]
L335  L-EU0204/7  [0204/7]
L336  L-EU0204/7  [0204/7]
L337  L-EU0204/7  [0204/7]
L338  L-EU0204/7  [0204/7]
L339  L-EU0204/7  [0204/7]
L340  L-EU0204/7  [0204/7]
L341  L-EU0204/7  [0204/7]
L342  L-EU0204/7  [0204/7]
L343  L-EU0204/7  [0204/7]
L344  L-EU0204/7  [0204/7]
L345  L-EU0204/7  [0204/7]
L346  L-EU0204/7  [0204/7]
L347  L-EU0204/7  [0204/7]
L348  L-EU0204/7  [0204/7]
L349  L-EU0204/7  [0204/7]
L350  L-EU0204/7  [0204/7]
L351  L-EU0204/7  [0204/7]
L352  L-EU0204/7  [0204/7]
L353  L-EU0204/7  [0204/7]
L354  L-EU0204/7  [0204/7]
L355  L-EU0204/7  [0204/7]
L356  L-EU0204/7  [0204/7]
L357  L-EU0204/7  [0204/7]
L358  L-EU0204/7  [0204/7]
L359  L-EU0204/7  [0204/7]
L360  L-EU0204/7  [0204/7]
L361  L-EU0204/7  [0204/7]
L362  L-EU0204/7  [0204/7]
L363  L-EU0204/7  [0204/7]
L364  L-EU0204/7  [0204/7]
R1  15k  R-EU_0207/12  [0207/12]